# Altium schematic sheet 磁開關電路_20240925.SchDoc
size A3
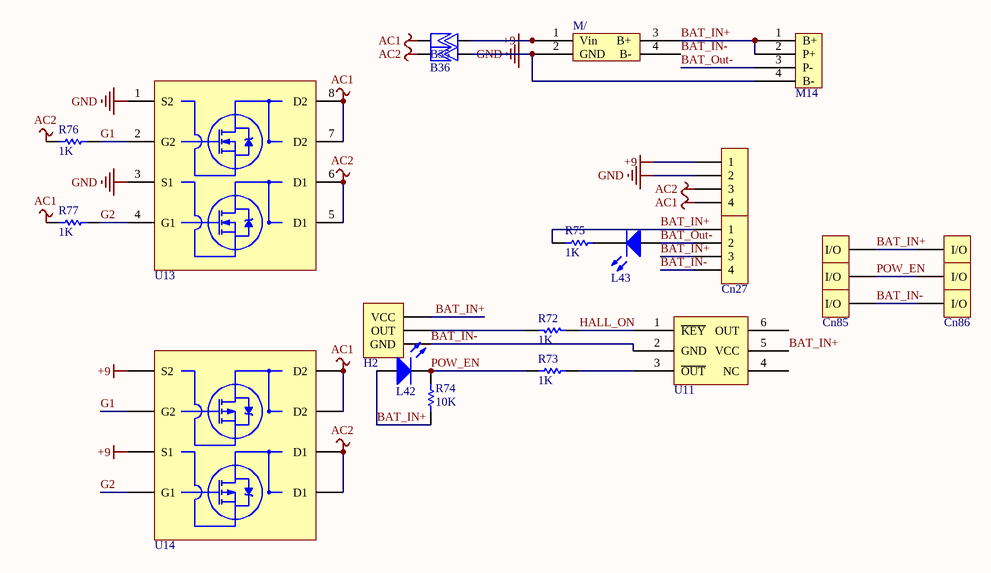
[diagram p0: 磁開關電路_20240925.SchDoc]

## Parts
B35  短路  [BYPASS-1206]  (value not drawn)
B36  短路  [BYPASS-1206]  (value not drawn)
Cn22  KF2510-4  [Connector_KF2510-4W]  (value not drawn)
Cn27  KF2510-4  [Connector_KF2510-4W]  (value not drawn)
Cn81  Contact  [Contact_Joints1*0.5]  (value not drawn)
Cn82  Contact  [Contact_Joints1*0.5]  (value not drawn)
Cn83  Contact  [Contact_Joints1*0.5]  (value not drawn)
Cn84  Contact  [Contact_Joints1*0.5]  (value not drawn)
Cn85  Contact  [Contact_Joints1*0.5]  (value not drawn)
Cn86  Contact  [Contact_Joints1*0.5]  (value not drawn)
H2  A3212  [SOT 23-3]  (value not drawn)
L42  藍  [LED-1206]  (value not drawn)
L43  藍  [LED-1206]  (value not drawn)
M14  Module_DW01A  [DW01A_Module]  (value not drawn)
M/  4056H+DW01A_Module  [4056H+DW01A_Module]  (value not drawn)
R72  1K  [Res-1206]
R73  1K  [Res-1206]
R74  10K  [Res_1/4]
R75  1K  [Res-1206]
R76  1K  [Res-1206]
R77  1K  [Res-1206]
U11  CS2130  [SOT 23-6]  (value not drawn)
U13  AO4800  [SOP-8]  (value not drawn)
U14  AO4801  [SOP-8]  (value not drawn)

## Nets
+9: B35.2 Cn22.1 M/.1(Vin) U14.1(S2) U14.3(S1)
AC1: B35.1 Cn22.4 R77.2 U13.7(D2) U13.8(D2) U14.7(D2) U14.8(D2)
AC2: B36.1 Cn22.3 R76.2 U13.5(D1) U13.6(D1) U14.5(D1) U14.6(D1)
GND: B36.2 Cn22.2 M14.4(B-) M/.2(GND) U13.1(S2) U13.3(S1)
BAT_IN+: Cn27.1 Cn27.3 Cn81.1(I/O) Cn82.1(I/O) H2.1(VCC) L42.2(A) M14.1(B+) M14.2(P+) M/.3(B+) R74.2 R75.2 U11.5(VCC)
BAT_IN-: Cn27.4 Cn85.1(I/O) Cn86.1(I/O) H2.3(GND) M/.4(B-) U11.2(GND)
BAT_Out-: Cn27.2 L43.2(A) M14.3(P-)
G1: R76.1 U13.2(G2) U14.2(G2)
G2: R77.1 U13.4(G1) U14.4(G1)
HALL_ON: R72.1 U11.1(~{KEY})
POW_EN: Cn83.1(I/O) Cn84.1(I/O) L42.1(K) R73.1 R74.1
NetH2_2: H2.2(OUT) R72.2
NetL43_1: L43.1(K) R75.1
NetR73_2: R73.2 U11.3(~{OUT})

Not connected (* = marked no-connect by the designer): U11 4(NC) 6(OUT)

## Library data of the parts
B35 B36 = Bypass: 短路焊點(如標註短路則需額外補錫使其短路)
Cn22 Cn27 = Contact(4P): 接線端子
Cn81-Cn86 = Contact: 接線端子、接點、郵票孔(非焊接元件)
H2 = Sensor_Hall: 感測器_霍爾
L42 L43 = LED
M14 = Module_DW01A: 鋰電池保護版
M/ = 4056H+DW01A_Module: 鋰電池充電保護板
R72-R77 = Res: 電阻
U11 = CS2130: 單鍵ON/OFF芯片; ComponentLink1Description: datasheet; ComponentLink1URL: http://www.szecm.com/Products/cs2130djkg.html
U13 = MOS_Dual N_AO4800: MOS,雙NMOS
U14 = MOS_Dual P_AO4801: MOS,雙PMOS